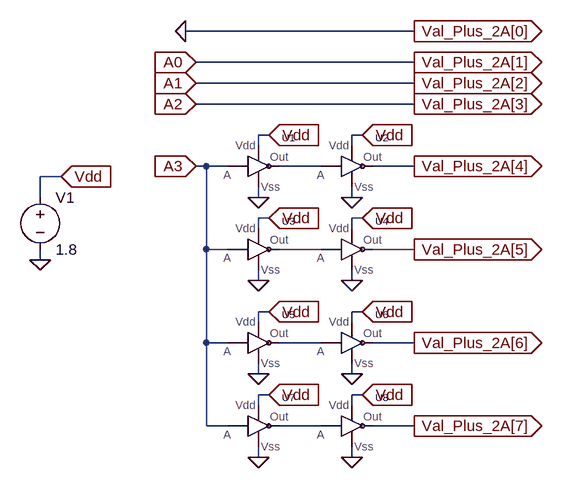
[diagram p0: schematic Val_Plus_2A.asc]
Val_Plus_2A.asc, the LTspice schematic file:
Version 4
SHEET 1 880 680
WIRE 416 -64 64 -64
WIRE 416 -16 80 -16
WIRE 416 16 80 16
WIRE 416 48 80 48
WIRE 192 96 176 96
WIRE 336 96 320 96
WIRE 176 112 176 96
WIRE 320 112 320 96
WIRE 96 144 80 144
WIRE 128 144 96 144
WIRE 272 144 208 144
WIRE 416 144 352 144
WIRE -128 160 -160 160
WIRE -160 192 -160 160
WIRE 176 192 176 176
WIRE 320 192 320 176
WIRE 192 224 176 224
WIRE 336 224 320 224
WIRE 176 240 176 224
WIRE 320 240 320 224
WIRE 96 272 96 144
WIRE 128 272 96 272
WIRE 272 272 208 272
WIRE 416 272 352 272
WIRE -160 288 -160 272
WIRE 176 320 176 304
WIRE 320 320 320 304
WIRE 192 368 176 368
WIRE 336 368 320 368
WIRE 176 384 176 368
WIRE 320 384 320 368
WIRE 96 416 96 272
WIRE 128 416 96 416
WIRE 272 416 208 416
WIRE 416 416 352 416
WIRE 176 464 176 448
WIRE 320 464 320 448
WIRE 192 496 176 496
WIRE 336 496 320 496
WIRE 176 512 176 496
WIRE 320 512 320 496
WIRE 96 544 96 416
WIRE 128 544 96 544
WIRE 272 544 208 544
WIRE 416 544 352 544
WIRE 176 592 176 576
WIRE 320 592 320 576
FLAG 64 -64 0
FLAG 80 -16 A0
IOPIN 80 -16 In
FLAG 80 16 A1
IOPIN 80 16 In
FLAG 80 48 A2
IOPIN 80 48 In
FLAG 416 -64 Val_Plus_2A[0]
IOPIN 416 -64 Out
FLAG 416 -16 Val_Plus_2A[1]
IOPIN 416 -16 Out
FLAG 416 16 Val_Plus_2A[2]
IOPIN 416 16 Out
FLAG 416 48 Val_Plus_2A[3]
IOPIN 416 48 Out
FLAG 80 144 A3
IOPIN 80 144 In
FLAG 176 192 0
FLAG 320 192 0
FLAG 192 96 Vdd
IOPIN 192 96 In
FLAG 336 96 Vdd
IOPIN 336 96 In
FLAG 416 144 Val_Plus_2A[4]
IOPIN 416 144 Out
FLAG 176 320 0
FLAG 320 320 0
FLAG 192 224 Vdd
IOPIN 192 224 In
FLAG 336 224 Vdd
IOPIN 336 224 In
FLAG 416 272 Val_Plus_2A[5]
IOPIN 416 272 Out
FLAG 176 464 0
FLAG 320 464 0
FLAG 192 368 Vdd
IOPIN 192 368 In
FLAG 336 368 Vdd
IOPIN 336 368 In
FLAG 416 416 Val_Plus_2A[6]
IOPIN 416 416 Out
FLAG 176 592 0
FLAG 320 592 0
FLAG 192 496 Vdd
IOPIN 192 496 In
FLAG 336 496 Vdd
IOPIN 336 496 In
FLAG 416 544 Val_Plus_2A[7]
IOPIN 416 544 Out
FLAG -160 288 0
FLAG -128 160 Vdd
IOPIN -128 160 In
SYMBOL NOT1 160 144 R0
SYMATTR InstName U1
SYMBOL NOT1 304 144 R0
SYMATTR InstName U2
SYMBOL NOT1 160 272 R0
SYMATTR InstName U3
SYMBOL NOT1 304 272 R0
SYMATTR InstName U4
SYMBOL NOT1 160 416 R0
SYMATTR InstName U5
SYMBOL NOT1 304 416 R0
SYMATTR InstName U6
SYMBOL NOT1 160 544 R0
SYMATTR InstName U7
SYMBOL NOT1 304 544 R0
SYMATTR InstName U8
SYMBOL voltage -160 176 R0
WINDOW 123 0 0 Left 0
WINDOW 39 0 0 Left 0
SYMATTR InstName V1
SYMATTR Value 1.8

The netlist it stands for:
* Val_Plus_2A.asc
XU1 Vdd 0 A3 N001 NOT1  ; pins Vdd Vss A Out
XU2 Vdd 0 N001 Val_Plus_2A[4] NOT1  ; pins Vdd Vss A Out
XU3 Vdd 0 A3 N002 NOT1  ; pins Vdd Vss A Out
XU4 Vdd 0 N002 Val_Plus_2A[5] NOT1  ; pins Vdd Vss A Out
XU5 Vdd 0 A3 N003 NOT1  ; pins Vdd Vss A Out
XU6 Vdd 0 N003 Val_Plus_2A[6] NOT1  ; pins Vdd Vss A Out
XU7 Vdd 0 A3 N004 NOT1  ; pins Vdd Vss A Out
XU8 Vdd 0 N004 Val_Plus_2A[7] NOT1  ; pins Vdd Vss A Out
V1 Vdd 0 1.8
.lib NOT1.sub
.backanno
.end